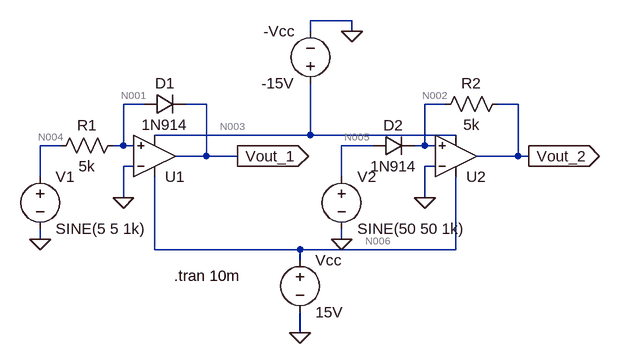
[diagram p0: schematic Q5.asc]
Q5.asc, the LTspice schematic file:
Version 4
SHEET 1 880 680
WIRE 464 -48 400 -48
WIRE 400 -32 400 -48
WIRE 464 -32 464 -48
WIRE 144 80 112 80
WIRE 240 80 208 80
WIRE 608 80 576 80
WIRE 720 80 688 80
WIRE 400 128 400 48
WIRE 400 128 160 128
WIRE 624 128 400 128
WIRE 16 144 -16 144
WIRE 112 144 112 80
WIRE 112 144 96 144
WIRE 128 144 112 144
WIRE 496 144 448 144
WIRE 576 144 576 80
WIRE 576 144 560 144
WIRE 592 144 576 144
WIRE 240 160 240 80
WIRE 240 160 192 160
WIRE 288 160 240 160
WIRE 720 160 720 80
WIRE 720 160 656 160
WIRE 736 160 720 160
WIRE 128 176 112 176
WIRE 592 176 576 176
WIRE -16 192 -16 144
WIRE 448 192 448 144
WIRE 112 224 112 176
WIRE 576 224 576 176
WIRE -16 288 -16 272
WIRE 448 288 448 272
WIRE 160 304 160 192
WIRE 384 304 160 304
WIRE 624 304 624 192
WIRE 624 304 384 304
WIRE 384 320 384 304
WIRE 384 432 384 400
FLAG 288 160 Vout_1
IOPIN 288 160 Out
FLAG 736 160 Vout_2
IOPIN 736 160 Out
FLAG 448 288 0
FLAG -16 288 0
FLAG 112 224 0
FLAG 576 224 0
FLAG 384 432 0
FLAG 464 -32 0
SYMBOL Opamps\\UniversalOpamp2 160 160 M180
SYMATTR InstName U1
SYMBOL Opamps\\UniversalOpamp2 624 160 M180
SYMATTR InstName U2
SYMBOL diode 496 160 R270
WINDOW 0 32 32 VTop 2
WINDOW 3 0 32 VBottom 2
SYMATTR InstName D2
SYMATTR Value 1N914
SYMBOL diode 144 96 R270
WINDOW 0 32 32 VTop 2
WINDOW 3 0 32 VBottom 2
SYMATTR InstName D1
SYMATTR Value 1N914
SYMBOL res 704 64 R90
WINDOW 0 0 56 VBottom 2
WINDOW 3 32 56 VTop 2
SYMATTR InstName R2
SYMATTR Value 5k
SYMBOL res 112 128 R90
WINDOW 0 0 56 VBottom 2
WINDOW 3 32 56 VTop 2
SYMATTR InstName R1
SYMATTR Value 5k
SYMBOL voltage -16 176 R0
WINDOW 123 0 0 Left 0
WINDOW 39 0 0 Left 0
SYMATTR InstName V1
SYMATTR Value SINE(5 5 1k)
SYMBOL voltage 448 176 R0
SYMATTR InstName V2
SYMATTR Value SINE(50 50 1k)
SYMBOL voltage 400 64 R180
WINDOW 0 24 96 Left 2
WINDOW 3 24 16 Left 2
SYMATTR InstName -Vcc
SYMATTR Value -15V
SYMBOL voltage 384 304 R0
SYMATTR InstName Vcc
SYMATTR Value 15V
TEXT 190 344 Left 2 !.tran 10m

The netlist it stands for:
* Q5.asc
XU1 N001 0 N006 N003 Vout_1 level.2 Avol=1Meg GBW=10Meg Slew=10Meg ilimit=25m rail=0 Vos=0 phimargin=45 en=0 enk=0 in=0 ink=0 Rin=500Meg  ; pins IN+ IN- V+ V- OUT
XU2 N002 0 N006 N003 Vout_2 level.2 Avol=1Meg GBW=10Meg Slew=10Meg ilimit=25m rail=0 Vos=0 phimargin=45 en=0 enk=0 in=0 ink=0 Rin=500Meg  ; pins IN+ IN- V+ V- OUT
D2 N005 N002 1N914
D1 N001 Vout_1 1N914
R2 Vout_2 N002 5k
R1 N001 N004 5k
V1 N004 0 SINE(5 5 1k)
V2 N005 0 SINE(50 50 1k)
V§-Vcc N003 0 -15V
Vcc N006 0 15V
.model D D
.lib standard.dio
.tran 10m
.lib UniversalOpamps2.sub
.backanno
.end

* Results of the author's LTspice run, read from the files saved beside the schematic
* Operating Point, zero values left out:
*   V(vout_1) = 15 V
*   V(n006) = 15 V
*   V(n003) = -15 V
*   V(n001) = 5 V
*   V(vout_2) = 20.01 V
*   V(n002) = 49.33 V
*   V(n005) = 50 V
*   V(n004) = 5 V
*   I(D1) = -2.53 nA
*   I(D2) = 5.865 mA
*   I(R1) = -7.47 nA
*   I(R2) = -5.864 mA
*   I(Vcc) = 307.3 µA
*   I(-vcc) = 5.558 mA
*   I(V2) = -5.865 mA
*   I(V1) = -7.47 nA
*   Ix(u1:1) = 10 nA
*   Ix(u1:3) = 3.278 µA
*   Ix(u1:4) = -3.486 µA
*   Ix(u1:5) = -2.53 nA
*   Ix(u2:1) = 98.66 nA
*   Ix(u2:3) = -310.6 µA
*   Ix(u2:4) = -5.554 mA
*   Ix(u2:5) = 5.864 mA
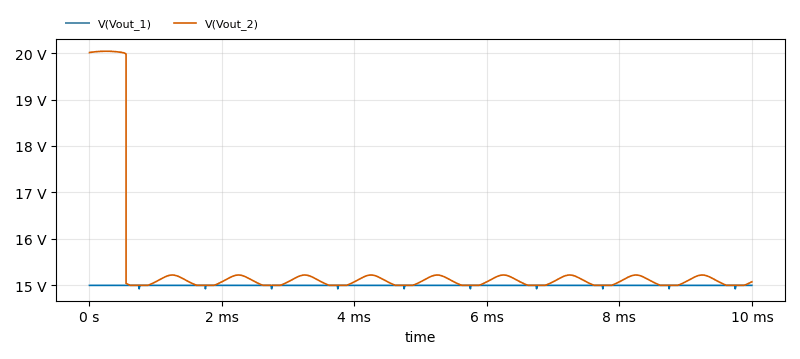
[diagram p1: Transient Analysis of Q5.asc, plotted from the saved traces]
* Transient Analysis, 1 run:
*   V(Vout_1): min 14.93 V, max 15 V, average 15 V, rms 15 V, last 15 V
*   V(Vout_2): min 15 V, max 20.04 V, average 15.36 V, rms 15.4 V, last 15.08 V